# EAGLE design BLDC-Controller-Open-Source (EAGLE 9.6.2)
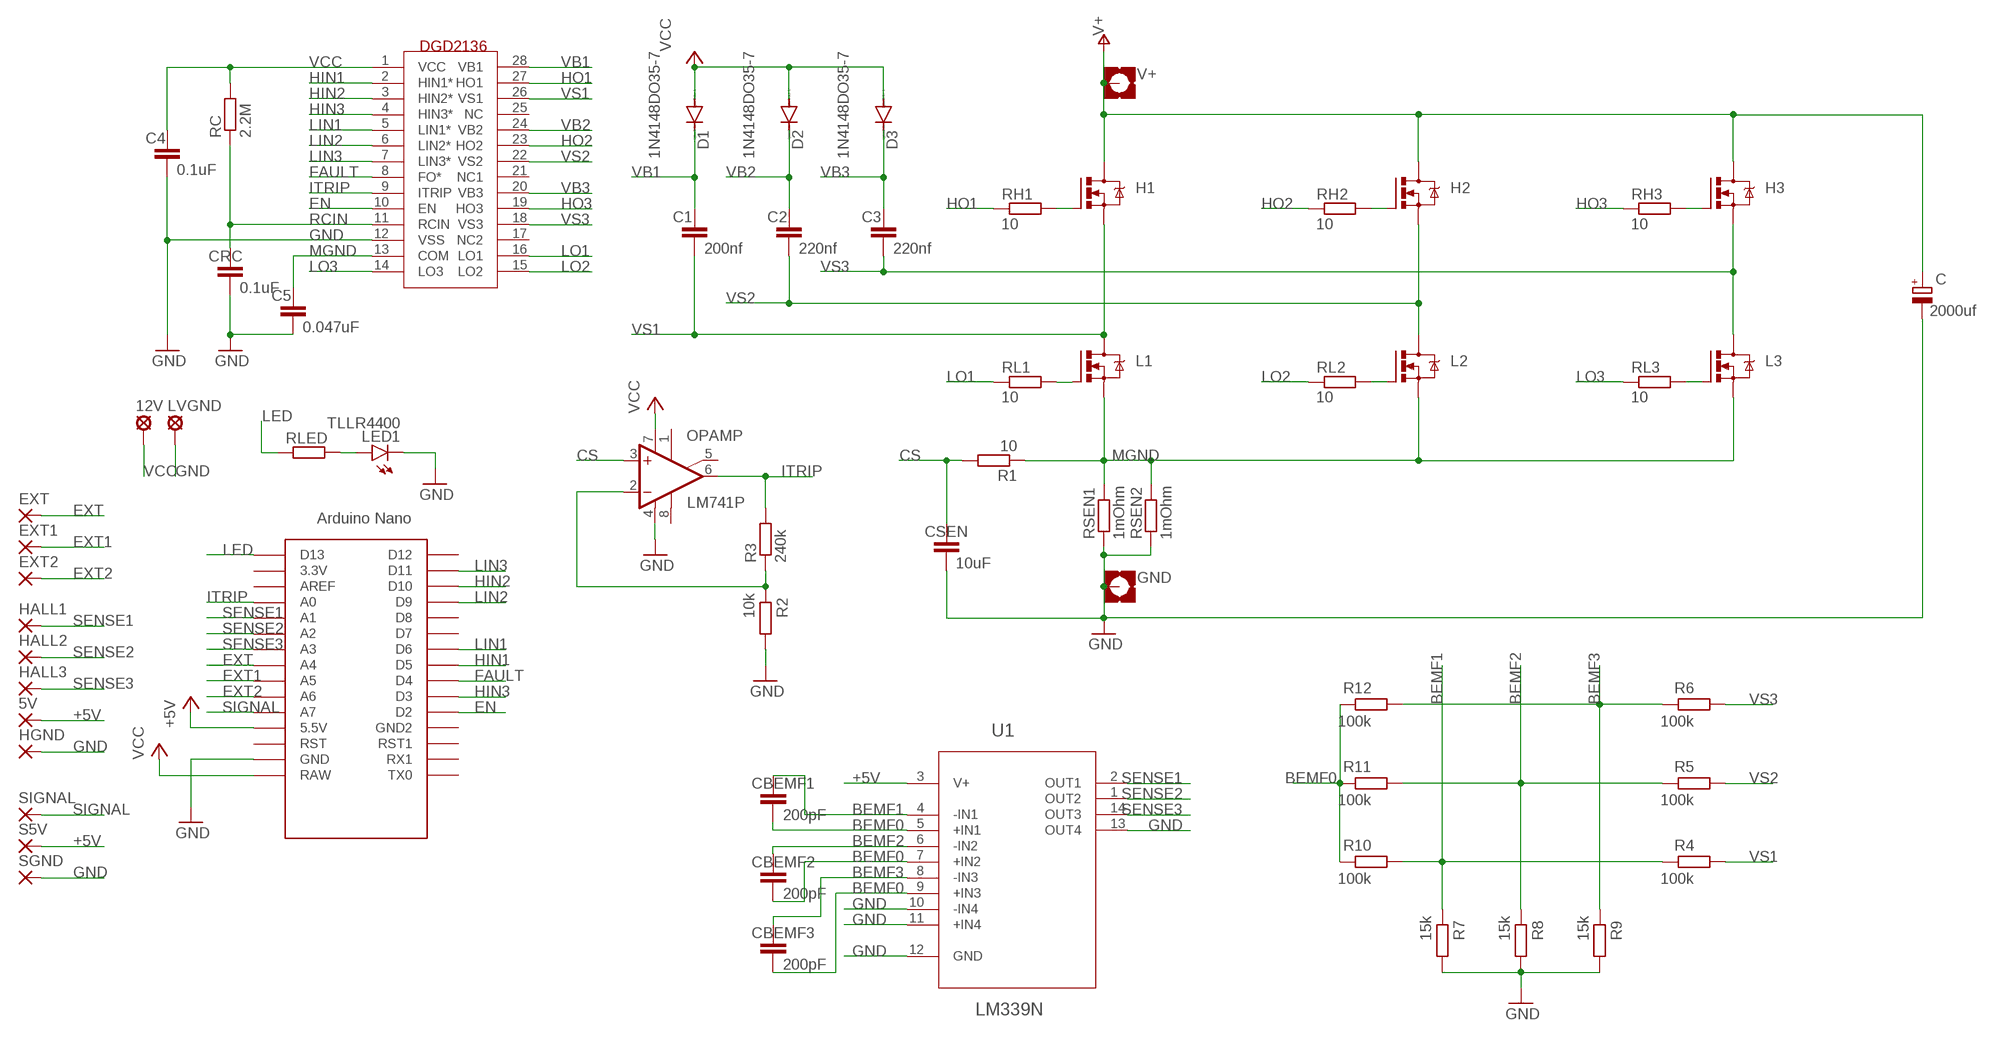
[diagram p0: schematic, sheet 1]

## Parts
5V  1,6/0,9  [1,6/0,9]
12V  MCS10B  [MCS10B]
C  2000uf  CPOL-EUE7.5-16  [E7,5-16]
C1  200nf  C-EU025-025X050  [C025-025X050]
C2  220nf  C-EU025-025X050  [C025-025X050]
C3  220nf  C-EU025-025X050  [C025-025X050]
C4  0.1uF  C-EU025-025X050  [C025-025X050]
C5  0.047uF  C-EU025-025X050  [C025-025X050]
CBEMF1  200pF  C-EU025-025X050  [C025-025X050]
CBEMF2  200pF  C-EU025-025X050  [C025-025X050]
CBEMF3  200pF  C-EU025-025X050  [C025-025X050]
CRC  0.1uF  C-EU025-025X050  [C025-025X050]
CSEN  10uF  C-EU025-025X050  [C025-025X050]
D1  1N4148DO35-7  [DO35-7]
D2  1N4148DO35-7  [DO35-7]
D3  1N4148DO35-7  [DO35-7]
EXT  1,6/0,9  [1,6/0,9]
EXT1  1,6/0,9  [1,6/0,9]
EXT2  1,6/0,9  [1,6/0,9]
GND  MOUNT-PAD-SQUARE3.6  [3,6-PAD-SQUARE]
H1  IRF540  [TO220BV]
H2  IRF540  [TO220BV]
H3  IRF540  [TO220BV]
HALL1  1,6/0,9  [1,6/0,9]
HALL2  1,6/0,9  [1,6/0,9]
HALL3  1,6/0,9  [1,6/0,9]
HGND  1,6/0,9  [1,6/0,9]
L1  IRF540  [TO220BV]
L2  IRF540  [TO220BV]
L3  IRF540  [TO220BV]
LED1  TLLR4400  [LED3MM]
LVGND  MCS10B  [MCS10B]
OPAMP  LM741P  [DIL08]
R1  10  R-EU_0204/7  [0204/7]
R2  10k  R-EU_0204/7  [0204/7]
R3  240k  R-EU_0204/7  [0204/7]
R4  100k  R-EU_0204/7  [0204/7]
R5  100k  R-EU_0204/7  [0204/7]
R6  100k  R-EU_0204/7  [0204/7]
R7  15k  R-EU_0204/7  [0204/7]
R8  15k  R-EU_0204/7  [0204/7]
R9  15k  R-EU_0204/7  [0204/7]
R10  100k  R-EU_0204/7  [0204/7]
R11  100k  R-EU_0204/7  [0204/7]
R12  100k  R-EU_0204/7  [0204/7]
RC  2.2M  R-EU_0204/7  [0204/7]
RH1  10  R-EU_0204/7  [0204/7]
RH2  10  R-EU_0204/7  [0204/7]
RH3  10  R-EU_0204/7  [0204/7]
RL1  10  R-EU_0204/7  [0204/7]
RL2  10  R-EU_0204/7  [0204/7]
RL3  10  R-EU_0204/7  [0204/7]
RLED  R-EU_0204/7  [0204/7]
RSEN1  1mOhm  R-EU_R2512  [R2512]
RSEN2  1mOhm  R-EU_R2512  [R2512]
S5V  1,6/0,9  [1,6/0,9]
SGND  1,6/0,9  [1,6/0,9]
SIGNAL  1,6/0,9  [1,6/0,9]
U1  LM339N  [DIP254P762X508-14]
U$1  NANO  [NANO]
U$2  DGD2136  [DGD2136]
V+  MOUNT-PAD-SQUARE3.6  [3,6-PAD-SQUARE]

## Nets
+5V: 5V.1(P) S5V.1(P) U1.3(V+) U$1.5V(5.5V)
BEMF0: CBEMF1.2 CBEMF2.2 CBEMF3.2 R10.2 R11.2 R12.2 U1.5(+IN1) U1.7(+IN2) U1.9(+IN3)
BEMF1: CBEMF1.1 R4.2 R7.2 R10.1 U1.4(-IN1)
BEMF2: CBEMF2.1 R5.2 R8.2 R11.1 U1.6(-IN2)
BEMF3: CBEMF3.1 R6.2 R9.2 R12.1 U1.8(-IN3)
CS: CSEN.1 OPAMP.3(+IN) R1.2
EN: U$1.D2 U$2.10(EN)
EXT: EXT.1(P) U$1.A4
EXT1: EXT1.1(P) U$1.A5
EXT2: EXT2.1(P) U$1.A6
FAULT: U$1.D4 U$2.8(FO*)
GND: C4.2 C5.2 C.- CRC.2 CSEN.2 GND.B3,6(MOUNT) HGND.1(P) LED1.K(C) LVGND.MP OPAMP.4(V-) R2.1 R7.1 R8.1 R9.1 RSEN1.1 RSEN2.1 SGND.1(P) U1.10(-IN4) U1.11(+IN4) U1.12(GND) U1.13(OUT4) U$1.GND U$2.12(VSS)
HIN1: U$1.D5 U$2.2(HIN1*)
HIN2: U$1.D10 U$2.3(HIN2*)
HIN3: U$1.D3 U$2.4(HIN3*)
HO1: RH1.1 U$2.27(HO1)
HO2: RH2.1 U$2.23(HO2)
HO3: RH3.1 U$2.19(HO3)
ITRIP: OPAMP.6(OUT) R3.2 U$1.A0 U$2.9(ITRIP)
LED: RLED.1 U$1.D13
LIN1: U$1.D6 U$2.5(LIN1*)
LIN2: U$1.D9 U$2.6(LIN2*)
LIN3: U$1.D11 U$2.7(LIN3*)
LO1: RL1.1 U$2.16(LO1)
LO2: RL2.1 U$2.15(LO2)
LO3: RL3.1 U$2.14(LO3)
MGND: C5.1 L1.S L2.S L3.S R1.1 RSEN1.2 RSEN2.2 U$2.13(COM)
N$1: L3.G RL3.2
N$2: H3.G RH3.2
N$3: L1.G RL1.2
N$4: L2.G RL2.2
N$5: H2.G RH2.2
N$6: H1.G RH1.2
N$7: OPAMP.2(-IN) R2.2 R3.1
N$10: LED1.A RLED.2
RCIN: CRC.1 RC.1 U$2.11(RCIN)
SENSE1: HALL1.1(P) U1.2(OUT1) U$1.A1
SENSE2: HALL2.1(P) U1.1(OUT2) U$1.A2
SENSE3: HALL3.1(P) U1.14(OUT3) U$1.A3
SIGNAL: SIGNAL.1(P) U$1.A7
V+: C.+ H1.D H2.D H3.D V+.B3,6(MOUNT)
VB1: C1.1 D1.C U$2.28(VB1)
VB2: C2.1 D2.C U$2.24(VB2)
VB3: C3.1 D3.C U$2.20(VB3)
VCC: 12V.MP C4.1 D1.A D2.A D3.A OPAMP.7(V+) RC.2 U$1.RAW U$2.1(VCC)
VS1: C1.2 H1.S L1.D R4.1 U$2.26(VS1)
VS2: C2.2 H2.S L2.D R5.1 U$2.22(VS2)
VS3: C3.2 H3.S L3.D R6.1 U$2.18(VS3)
Unconnected: OPAMP.1(ON1) OPAMP.5(ON2) OPAMP.8(OPT) U$1.3.3V U$1.AREF U$1.D7 U$1.D8 U$1.D12 U$1.GND1(GND2) U$1.RST U$1.RST1 U$1.RX1 U$1.TX0 U$2.17(NC2) U$2.21(NC1) U$2.25(NC)

## Library data of the parts
5V EXT EXT1 EXT2 HALL1-HALL3 HGND S5V SGND SIGNAL = wirepad:1,6/0,9: THROUGH-HOLE PAD
12V LVGND = solpad:MCS10B: SOLDER PAD MC S1, distributor Buerklin, 15F505
C = modified cap:CPOL-EU: POLARIZED CAPACITOR, European symbol; SPICEPREFIX: C
C1-C5 CBEMF1-CBEMF3 CRC CSEN = rcl:C-EU: CAPACITOR, European symbol; SPICEPREFIX: C
D1-D3 = diode:1N4148: DIODE high speed (Philips)
GND V+ = holes:MOUNT-PAD-SQUARE: MOUNTING PAD, square
H1-H3 L1-L3 = transistor-power:IRF540: HEXFET Power MOSFET
LED1 = led:TLLR4400: Low Current (2mA) LED 3 mm Tinted Diffused Package color RED Source: Data sheet <http://www.farnell.com/datasheets/391100.pdf>; MF: VISHAY SEMICONDUCTOR; OC_FARNELL: 1612437
OPAMP = linear:*741: OP AMP
R1-R12 RC RH1-RH3 RL1-RL3 RLED = rcl:R-EU_: RESISTOR, European symbol; SPICEPREFIX: R
RSEN1 RSEN2 = modified cap:R-EU_: RESISTOR, European symbol; SPICEPREFIX: R
U1 = LM339N:LM339N: Quad Comparators Check prices <https://pricing.snapeda.com/parts/LM339N/ON%20Semiconductor/view-part?ref=eda>; AVAILABILITY: Warning; DESCRIPTION: Comparator General Purpose CMOS, Open-Collector, TTL 14-PDIP; MF: ON Semiconductor; MP: LM339N; PACKAGE: DIP-14 ON Semiconductor; PRICE: None; PURCHASE-URL: https://pricing.snapeda.com/search/part/LM339N/?ref=eda
U$1 = Arduino-clone:NANO: Arduino Nano
U$2 = dgd2136:DGD2136

## Board
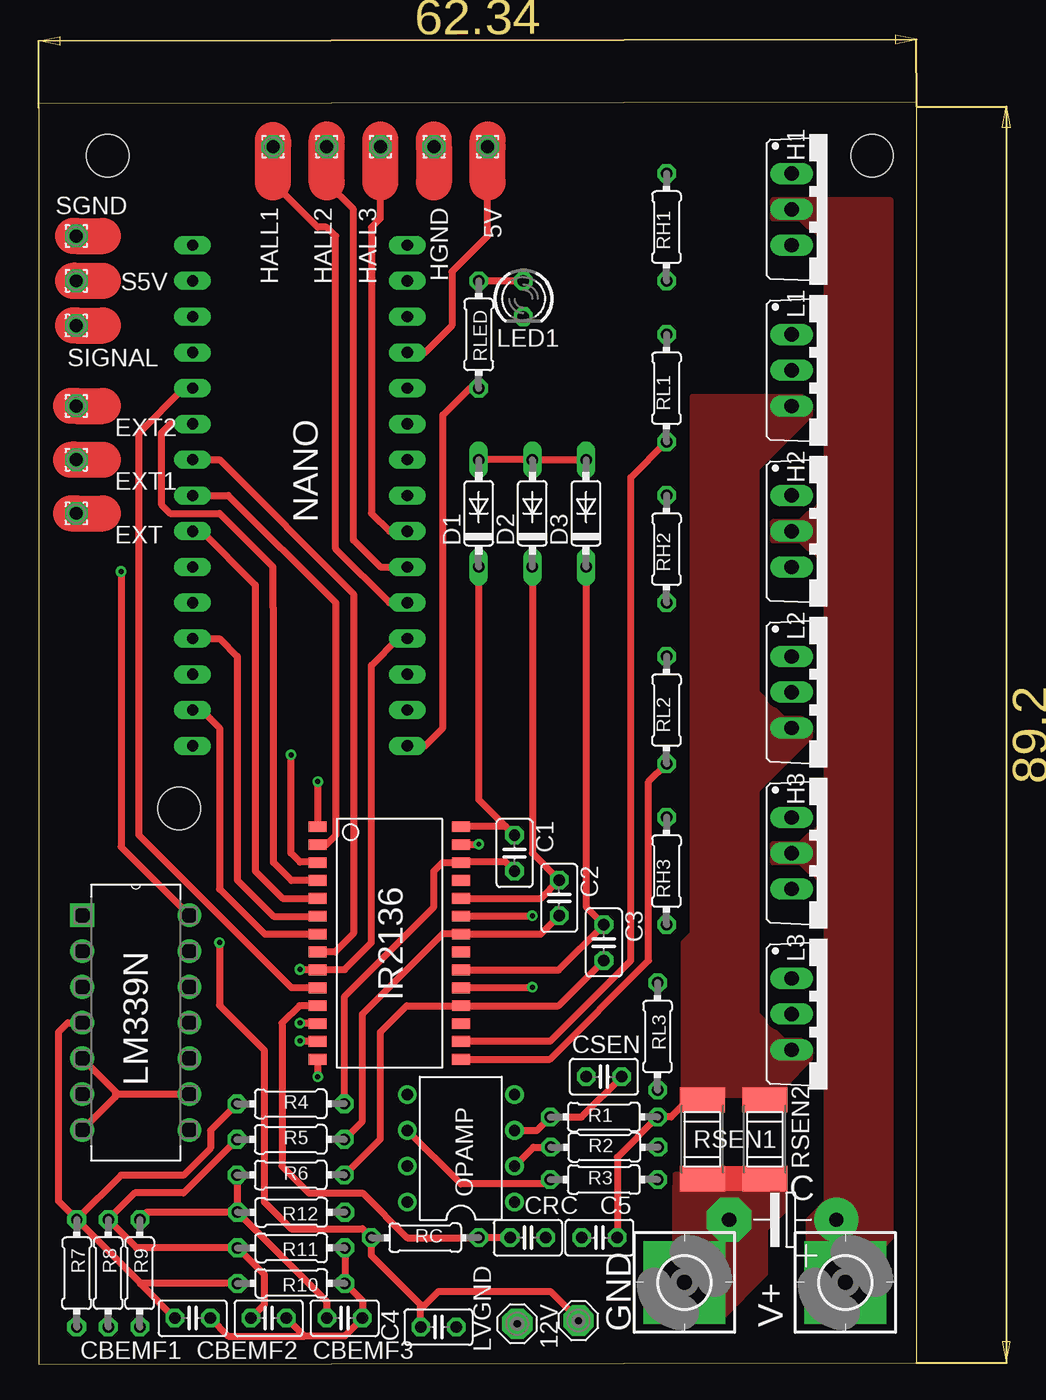
[diagram p1: board, top side]
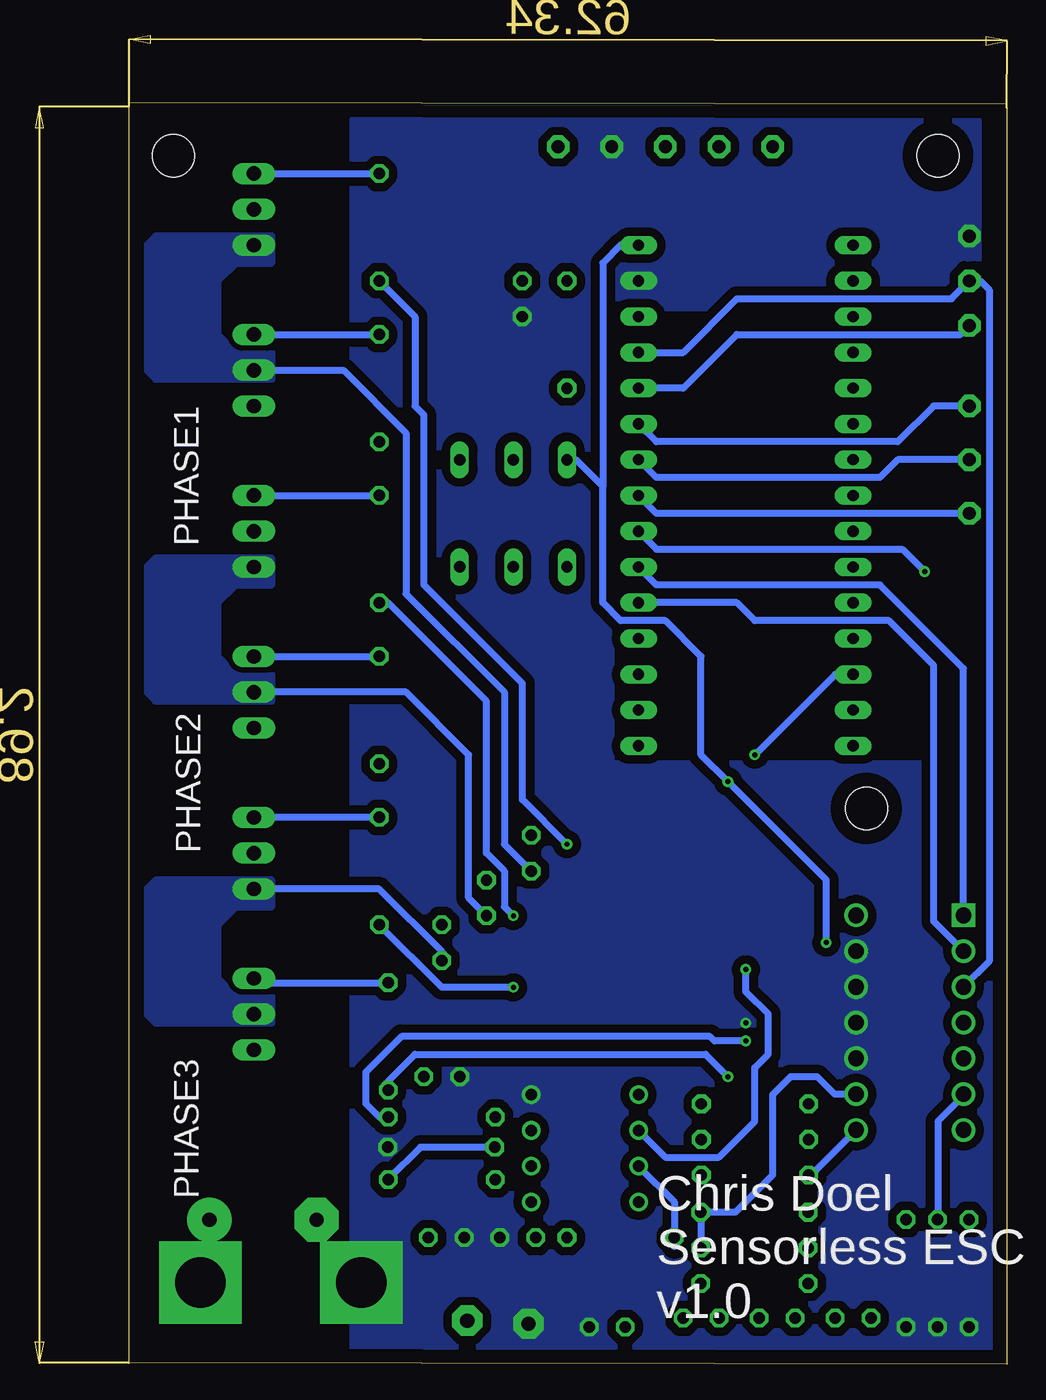
[diagram p2: board, bottom side, seen from below]

Size 62.34 x 89.62 mm. Coordinates in mm from the lower left corner, seen from the top.
Outline: 0,0 62.34,0.1 62.34,89.62 0,89.52 0,0
Copper layers (1*16): Top 0.035mm / dielectric 1.5mm / Bottom 0.035mm
Design rules "default": minimum track width 6mil, minimum drill 0.35mm, track to track 6mil, track to pad 6mil, pad to pad 6mil, via to via 6mil, smd to smd 6mil, copper to edge 40mil, drill to drill 6mil, minimum pad ring 10mil, minimum via ring 8mil, stop-mask expansion 4mil, vias tented up to drill 0mil, thermal gap 10mil
Holes 3 mm at 4.89,85.83 59.18,85.83 9.97,39.47

### Footprints (pad centres in the part's own frame; a part is rotated, then mirrored left to right if it is on the bottom)
1,6/0,9 = drill 0.914 pad 1.6 octagon: 1 0,0
MCS10B = drill 1.016 pad 2.159 octagon: MP 0,0
E7,5-16 = drill 1.016 pad 3.15: + -3.81,0 | drill 1.016 pad 3.15 octagon: - 3.81,0
C025-025X050 = drill 0.813 octagon: 1 -1.27,0; 2 1.27,0
DO35-7 = drill 0.813 long: A 3.81,0; C -3.81,0
3,6-PAD-SQUARE = drill 3.6 pad 5.842 square: B3,6 0,0
TO220BV = drill 1.016 long: D 0,-2.54; G -2.54,-2.54; S 2.54,-2.54
LED3MM = drill 0.813 octagon: A -1.27,0; K 1.27,0
DIL08 = drill 0.813 pad 1.27: 1 -3.81,-3.81; 2 -1.27,-3.81; 3 1.27,-3.81; 4 3.81,-3.81; 5 3.81,3.81; 6 1.27,3.81; 7 -1.27,3.81; 8 -3.81,3.81
0204/7 = drill 0.813 octagon: 1 -3.81,0; 2 3.81,0
R2512 = smd 1.8 x 3.2: 1 -2.8,0; 2 2.8,0
DIP254P762X508-14 = drill 1.118 square: 1 -7.62,15.24 | drill 1.118: 2 -7.62,12.7; 3 -7.62,10.16; 4 -7.62,7.62; 5 -7.62,5.08; 6 -7.62,2.54; 7 -7.62,0; 8 0,0; 9 0,2.54; 10 0,5.08; 11 0,7.62; 12 0,10.16; 13 0,12.7; 14 0,15.24
NANO = drill 0.8 long: 3.3V -10.16,24.13; 5V -10.16,-1.27; A0 -10.16,19.05; A1 -10.16,16.51; A2 -10.16,13.97; A3 -10.16,11.43; A4 -10.16,8.89; A5 -10.16,6.35; A6 -10.16,3.81; A7 -10.16,1.27; AREF -10.16,21.59; D2 5.08,1.27; D3 5.08,3.81; D4 5.08,6.35; D5 5.08,8.89; D6 5.08,11.43; D7 5.08,13.97; D8 5.08,16.51; D9 5.08,19.05; D10 5.08,21.59; D11 5.08,24.13; D12 5.08,26.67; D13 -10.16,26.67; GND -10.16,-6.35; GND1 5.08,-1.27; RAW -10.16,-8.89; RST -10.16,-3.81; RST1 5.08,-3.81; RX1 5.08,-6.35; TX0 5.08,-8.89
DGD2136 = smd 0.762 x 1.27: 1 -8.145,-5.24; 2 -6.875,-5.24; 3 -5.605,-5.24; 4 -4.335,-5.24; 5 -3.065,-5.24; 6 -1.795,-5.24; 7 -0.525,-5.24; 8 0.745,-5.24; 9 2.015,-5.24; 10 3.285,-5.24; 11 4.555,-5.24; 12 5.825,-5.24; 13 7.095,-5.24; 14 8.365,-5.24; 15 8.365,4.92; 16 7.095,4.92; 17 5.825,4.92; 18 4.555,4.92; 19 3.285,4.92; 20 2.015,4.92; 21 0.745,4.92; 22 -0.525,4.92; 23 -1.795,4.92; 24 -3.065,4.92; 25 -4.335,4.92; 26 -5.605,4.92; 27 -6.875,4.92; 28 -8.145,4.92

### Placement (x,y rotation side)
5V  31.88,86.46 180 top
12V  38.33,3.1 180 top
C  52.83,10.26 180 top
C1  33.79,36.3 270 top
C2  36.96,33.12 270 top
C3  40.14,29.95 270 top
C4  28.39,2.64 0 top
C5  39.82,8.99 180 top
CBEMF1  10.92,3.28 0 top
CBEMF2  16.32,3.28 0 top
CBEMF3  21.72,3.28 0 top
CRC  34.74,8.99 0 top
CSEN  40.14,20.42 180 top
D1  31.25,60.42 90 top
D2  35.05,60.42 90 top
D3  38.86,60.42 90 top
EXT  2.67,60.42 90 top
EXT1  2.67,64.23 0 top
EXT2  2.67,68.05 0 top
GND  45.85,5.82 0 top
H1  56.01,82.02 270 top
H2  56.01,59.16 270 top
H3  56.01,36.3 270 top
HALL1  16.64,86.46 180 top
HALL2  20.45,86.46 180 top
HALL3  24.26,86.46 180 top
HGND  28.07,86.46 90 top
L1  56.01,70.58 270 top
L2  56.01,47.73 270 top
L3  56.01,24.87 270 top
LED1  34.42,75.66 270 top
LVGND  33.98,2.88 180 top
OPAMP  29.97,15.34 90 top
R1  40.14,17.56 180 top
R2  40.17,15.41 180 top
R3  40.14,13.12 180 top
R4  17.89,18.49 180 top
R5  17.89,15.97 180 top
R6  17.89,13.45 180 top
R7  2.7,6.47 90 top
R8  4.93,6.47 90 top
R9  7.17,6.47 90 top
R10  17.93,5.75 0 top
R11  17.93,8.27 0 top
R12  17.93,10.79 0 top
RC  27.44,8.99 180 top
RH1  44.58,80.75 90 top
RH2  44.58,57.89 90 top
RH3  44.58,35.02 90 top
RL1  44.58,69.31 90 top
RL2  44.58,46.45 90 top
RL3  43.95,23.28 90 top
RLED  31.25,73.12 90 top
RSEN1  47.12,15.97 90 top
RSEN2  51.57,15.97 90 top
S5V  2.67,76.94 180 top
SGND  2.67,80.11 180 top
SIGNAL  2.67,73.76 180 top
U1  10.7,16.64 0 top
U$1  16,70.58 180 top
U$2  25.06,30.02 270 top
V+  57.28,5.82 0 top

### Tracks (layer width: path | path; a pad name or v marks a point on that pad's centre or on a via)
+5V
  Top 0.508: U$1.5V 27.44,71.86 29.34,73.76 29.34,77.57 31.88,80.11 31.88,83.92
  Top 2.54: 4.58,76.94 S5V.1 2.42,76.94 | 31.88,86.97 5V.1 31.88,83.92
  Bottom 0.508: U$1.5V 22.99,71.86 19.18,75.66 3.94,75.66 S5V.1 1.91,76.94 1.27,76.3 1.27,28.62 U1.3
BEMF0
  Top 0.508: U1.9 5.62,19.18 5.43,19.37 | 5.43,19.37 U1.5 | R11.2 R10.2 22.99,4.5 CBEMF3.2 21.72,2.01 18.86,2.01 | 5.43,19.37 5.43,18.99 U1.7 | 18.86,2.01 CBEMF2.2 | CBEMF1.2 13.47,2.01 18.86,2.01
  Bottom 0.508: U1.9 12.22,19.18 13.47,20.42 15.37,20.42 16.64,19.15 16.64,13.44 19.28,10.79 R12.2 R11.2
BEMF1
  Top 0.508: R7.2 1.4,11.58 1.4,23.59 2.06,24.26 U1.4 | R4.2 12.2,16.61 12.2,15.34 10.29,13.44 5.85,13.44 R7.2 | 7.23,5.75 R7.2 | R10.1 7.23,5.75 | 7.23,5.75 7.23,5.7 CBEMF1.1
BEMF2
  Top 0.508: R5.2 10.28,12.17 6.82,12.17 R8.2 6.94,8.27 R11.1 16,6.38 16,4.23 CBEMF2.1
  Bottom 0.508: R8.2 4.89,10.32 4.89,17.24 3.08,19.05 U1.6
BEMF3
  Top 0.508: R12.1 7.69,10.79 R9.2 | R6.2 14.08,10.83 R12.1 | R12.1 20.45,4.46 CBEMF3.1
  Bottom 0.508: U1.8 13.9,13.45 R6.2
CS
  Top 0.508: OPAMP.3 35.37,16.61 R1.2 38.55,17.56 CSEN.1
EN
  Top 0.508: 19.78,26.77 U$2.10 17.95,26.73 7.11,37.56 7.11,66.14 10.29,69.31 U$1.D2
EXT
  Top 2.54: 2.29,60.42 EXT.1 4.58,60.42
  Bottom 0.508: U$1.A4 24.89,60.42 EXT.1
EXT1
  Top 2.54: 2.29,64.23 EXT1.1 4.58,64.23
  Bottom 0.508: EXT1.1 7.75,64.23 9.02,62.97 24.89,62.97 U$1.A5
EXT2
  Top 2.54: 4.58,68.05 EXT2.1 2.29,68.05
  Bottom 0.508: EXT2.1 5.21,68.05 7.75,65.5 24.89,65.5 U$1.A6
FAULT
  Top 0.508: U$1.D4 12.83,64.23 22.36,54.71 22.36,30.58 21.05,29.27 U$2.8
GND  (via drill 0.35)
  Top 0.508: U$2.12 18.58,24.2 v18.55,24.23
  Top 1.778: RSEN2.1 RSEN1.1
  Top 2.54: 4.58,80.11 SGND.1 2.42,80.11 | 28.07,86.97 HGND.1 28.07,83.92 | 28.07,86.97
  pour Top (isolate 0.406, no thermals): 45.21,13.44 45.21,8.36 43.31,8.36 43.31,3.28 48.39,3.28 51.57,6.45 51.57,9.63 52.83,10.9 52.83,12.8 52.83,13.44
  pour Bottom (isolate 0.61, no thermals): 0.77,42.64 28.07,42.64 28.07,75.03 2.03,75.03 2.03,88.36 46.48,88.36 46.48,0.74 0.77,0.74
HIN1
  Top 0.508: U$1.D5 13.47,61.69 21.08,54.07 21.08,37.56 20.42,36.89 U$2.2
HIN2  (via drill 0.35)
  Top 0.508: U$2.3 19.78,35.66 18.55,35.66 17.91,36.3 v17.91,43.28
  Bottom 0.508: v17.91,43.28 12.2,48.99 U$1.D10
HIN3
  Top 0.508: U$1.D3 9.34,66.78 8.7,66.14 8.7,61.06 9.34,60.42 12.83,60.42 16.64,56.61 16.64,53.74 16.67,53.71 16.67,35.63 17.95,34.35 U$2.4
HO1  (via drill 0.35)
  Top 0.508: U$2.27 30.01,36.93 v31.25,36.93
  Bottom 0.508: RH1.1 42.04,74.39 42.04,68.05 41.4,67.41 41.4,55.34 34.42,48.36 34.42,40.1 v31.25,36.93
HO2  (via drill 0.35)
  Top 0.508: U$2.23 30.01,31.85 v35.05,31.85
  Bottom 0.508: RH2.1 43.95,54.07 36.96,47.09 36.96,36.3 35.69,35.02 35.69,32.48 v35.05,31.85
HO3  (via drill 0.35)
  Top 0.508: v35.05,26.77 35.02,26.73 U$2.19
  Bottom 0.508: v35.05,26.77 40.14,26.77 RH3.1
ITRIP  (via drill 0.35)
  Top 0.508: U$2.9 19.81,28.04 | U$2.9 19.85,28.04 21.72,28.04 23.62,29.95 23.62,49.63 25.53,51.53 U$1.A0 | R3.2 36.01,12.8 29.97,12.8 OPAMP.6 | v18.55,28.04 19.78,28.04 U$2.9
  Bottom 0.508: OPAMP.6 24.26,14.71 20.45,14.71 17.91,17.24 17.91,21.05 16.96,22.01 16.96,24.87 18.55,26.45 v18.55,28.04
LED
  Top 0.508: U$1.D13 27.44,43.91 28.7,45.19 28.7,67.41 30.61,69.31 RLED.1
LIN1
  Top 0.508: U$1.D6 11.56,59.16 15.37,55.34 15.37,35.02 17.31,33.09 U$2.5
LIN2
  Top 0.508: U$1.D9 12.83,51.53 14.1,50.27 14.1,34.39 16.67,31.81 U$2.6
LIN3
  Top 0.508: U$1.D11 11.56,46.45 12.83,45.19 12.83,33.75 16.04,30.55 U$2.7
LO1
  Top 0.508: RL1.1 42.04,62.97 42.04,28.67 36.33,22.96 30.01,22.96 U$2.16
LO2
  Top 0.508: RL2.1 43.31,41.38 43.31,28.67 36.29,21.66 U$2.15
LO3  (via drill 0.35)
  Top 0.508: U$2.14 v19.81,20.42
  Bottom 0.508: RL3.1 43.95,20.1 42.04,22.01 21.4,22.01 v19.81,20.42
MGND  (via drill 0.35)
  Top 0.508: RSEN1.2 46.11,18.77 44.9,17.56 R1.1 41.09,14.71 C5.1 | U$2.13 18.58,22.92 v18.55,22.96
  Bottom 0.508: 43.63,17.24 R1.1 44.58,17.56 45.53,18.52 45.53,20.74 42.99,23.28 21.08,23.28 20.77,22.96 v18.55,22.96
  pour Top (isolate 0.406, no thermals): 46.48,68.68 54.11,68.68 54.74,68.05 54.74,67.41 50.93,63.6 50.93,47.73 52.83,45.82 54.11,45.82 54.74,45.19 54.74,44.55 50.93,40.74 50.93,24.87 52.83,22.96 54.11,22.96 54.74,22.33 54.74,21.69 52.83,19.79 52.83,19.15 45.85,19.15 45.85,29.95 46.48,30.58
N$1
  Bottom 0.508: L3.G 53.15,27.09 RL3.2
N$2
  Bottom 0.508: RH3.2 H3.G
N$3
  Bottom 0.508: L1.G RL1.2
N$4
  Bottom 0.508: L2.G RL2.2
N$5
  Bottom 0.508: H2.G RH2.2
N$6
  Bottom 0.508: H1.G RH1.2
N$7
  Top 0.508: OPAMP.2 35.13,15.41 R2.2
  Bottom 0.508: R2.2 41.65,15.41 R3.1
N$10
  Top 0.508: RLED.2 LED1.A
RCIN
  Top 0.508: U$2.11 18.51,25.46 17.28,24.23 17.28,14.07 19.18,12.17 22.99,12.17 26.17,8.99 RC.1 CRC.1
SENSE1
  Top 0.508: U$1.A1 24.89,54.07 21.08,57.89 21.08,80.11 20.45,80.75 19.81,80.75 16.64,83.92
  Top 2.54: 16.64,83.92 HALL1.1 | HALL1.1 16.64,86.95 HALL1.1
  Bottom 0.508: U1.2 5.21,31.46 5.21,49.63 8.39,52.8 17.91,52.8 19.18,54.07 U$1.A1
SENSE2
  Top 0.508: U$1.A2 24.26,56.61 22.36,58.52 22.36,82.02 20.45,83.92
  Top 2.54: 20.45,86.96 HALL2.1 20.45,83.92
  Bottom 0.508: U1.1 3.08,49.41 9.02,55.34 24.89,55.34 U$1.A2
SENSE3  (via drill 0.35)
  Top 0.508: U$1.A3 24.89,59.16 23.62,60.42 23.62,80.75 24.26,81.38 24.26,83.92 | v5.84,56.3 5.84,36.74 U1.14
  Top 2.54: 24.26,86.96 HALL3.1 24.26,83.92
  Bottom 0.508: U$1.A3 24.89,57.89 7.43,57.89 v5.84,56.3
SIGNAL
  Top 2.54: 4.58,73.76 SIGNAL.1 2.42,73.76
  Bottom 0.508: SIGNAL.1 3.31,73.12 19.18,73.12 22.99,69.31 U$1.A7
V+
  pour Top (isolate 0.406, no thermals): 54.74,3.28 54.74,10.26 56.01,11.53 56.01,33.75 54.11,35.66 52.2,35.66 52.2,36.93 54.11,36.93 56.01,38.84 56.01,56.61 54.11,58.52 52.2,58.52 52.2,59.79 54.11,59.79 56.01,61.69 56.01,79.47 54.11,81.38 52.2,81.38 52.2,82.65 60.45,82.65 60.45,8.99 59.82,8.36 59.82,3.28
VB1
  Top 0.508: U$2.28 30.01,38.2 33.15,38.2 C1.1 31.25,40.1 D1.C
VB2
  Top 0.508: U$2.24 35.65,33.09 C2.1 35.05,36.3 D2.C
VB3
  Top 0.508: U$2.20 36.92,28 C3.1 38.86,32.48 D3.C
VCC  (via drill 0.35)
  Top 0.508: D1.A D2.A D3.A | v19.81,41.38 U$2.1 | 12V.MP 38.33,3.18 36.33,5.18 28.39,5.18 27.12,3.91 C4.1 27.12,4.23 23.62,7.72 RC.2 22.99,9.63 17.91,9.63 16,11.53 16,22.33 12.83,25.5 v12.83,29.95
  Bottom 0.508: U$1.RAW 27.44,79.47 28.7,78.2 28.7,62.33 | v12.83,29.95 12.83,34.39 v19.81,41.38 21.72,43.28 21.72,50.27 24.26,52.8 27.44,52.8 28.7,54.07 28.7,62.33 | 28.7,62.33 30.61,64.23 D1.A | 23.62,8.36 RC.2 23.62,11.53 OPAMP.7
VS1
  Top 0.508: C1.2 33.15,35.66 30.01,35.66 U$2.26 28.67,35.62 28.07,35.02 28.07,32.48 21.72,26.13 21.72,18.52 R4.1
  Bottom 0.508: L1.D 47.12,70.58 42.67,66.14 42.67,54.71 35.69,47.73 35.69,36.93 C1.2
  pour Bottom (isolate 0.406, no thermals): 52.2,80.11 60.45,80.11 61.09,79.47 61.09,70.58 60.45,69.95 52.2,69.95 52.2,71.86 54.74,71.86 56.01,73.12 56.01,76.94 54.74,78.2 52.2,78.2
VS2
  Top 0.508: C2.2 35.65,30.55 U$2.22 29.94,30.58 28.7,30.58 22.99,24.87 22.99,17.26 R5.1
  Bottom 0.508: C2.2 38.23,33.12 38.23,43.28 42.67,47.73 L2.D
  pour Bottom (isolate 0.406, no thermals): 52.2,57.25 60.45,57.25 61.09,56.61 61.09,47.73 60.45,47.09 52.2,47.09 52.2,48.99 54.74,48.99 56.01,50.27 56.01,54.07 54.74,55.34 52.2,55.34
VS3
  Top 0.508: C3.2 36.92,25.46 U$2.18 26.13,25.46 24.26,23.59 24.26,16.01 R6.1
  Bottom 0.508: C3.2 40.14,29.31 44.58,33.75 H3.S
  pour Bottom (isolate 0.406, no thermals): 52.2,34.39 60.45,34.39 61.09,33.75 61.09,24.87 60.45,24.23 52.2,24.23 52.2,26.13 54.74,26.13 56.01,27.41 56.01,31.21 54.74,32.48 52.2,32.48

### Text on the board
tNames: NANO | IR2136 | LM339N | V+ | GND
bNames: PHASE1 | PHASE2 | PHASE3 | Chris Doel / Sensorless ESC / v1.0